# Altium schematic sheet Sheet1.SchDoc
size A
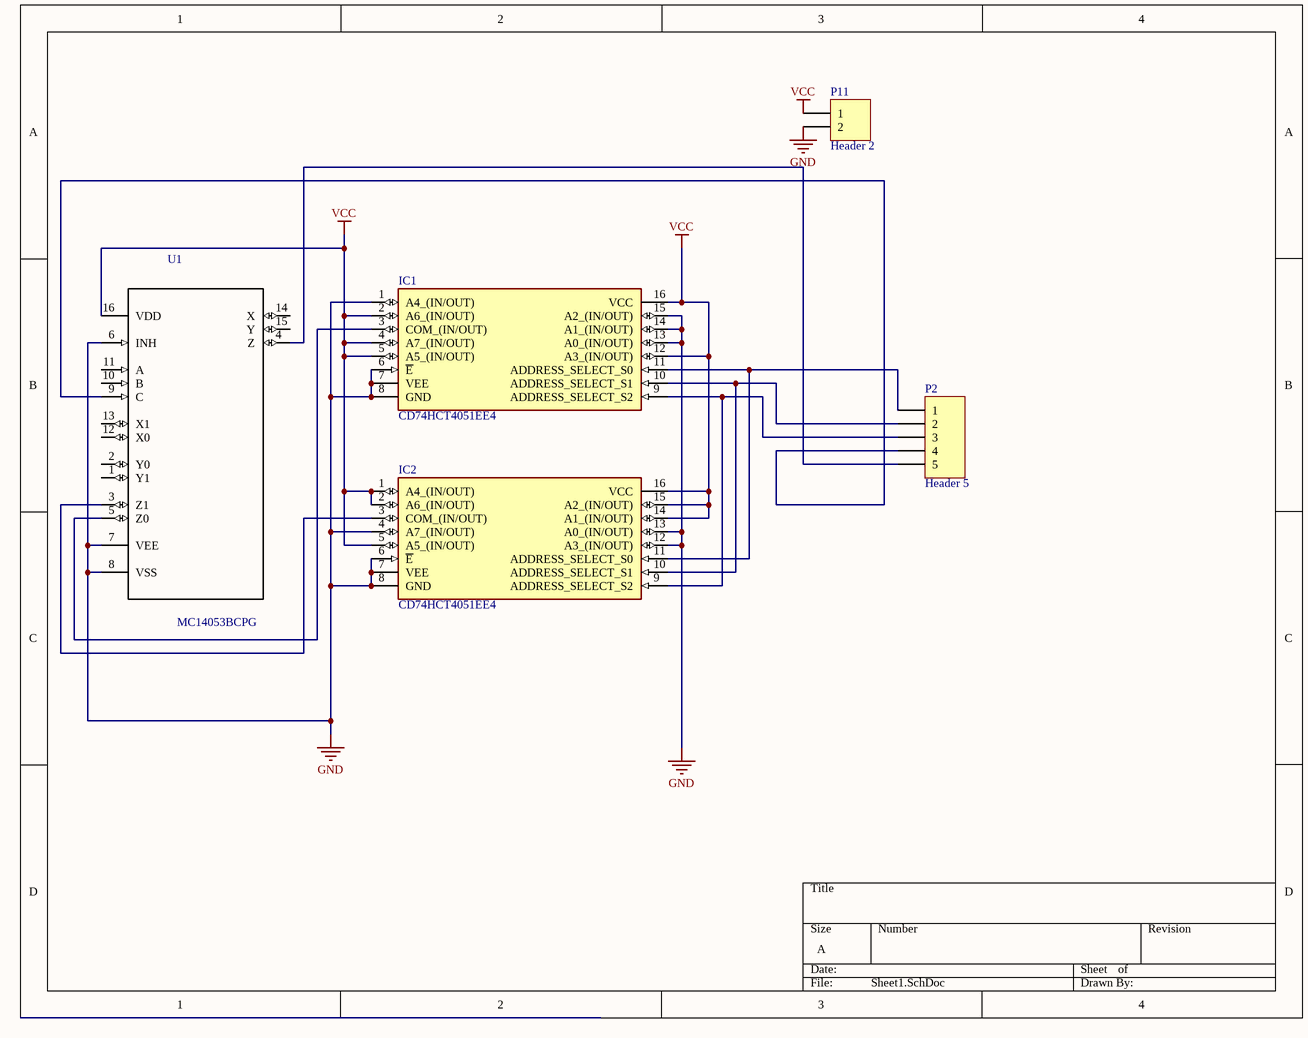
[diagram p0: Sheet1.SchDoc]

## Parts
IC1  CD74HCT4051EE4  [DIP794W53P254L1930H508Q16N]
IC2  CD74HCT4051EE4  [DIP794W53P254L1930H508Q16N]
P2  Header 5  [HDR1X5]
P11  Header 2  [HDR1X2]
U1  MC14053BCPG  [*DIP254P762X444-16]

## Nets
GND: IC1.1(A4_(IN/OUT)) IC1.6(~{E}) IC1.7(VEE) IC1.8(GND) IC1.13(A0_(IN/OUT)) IC1.14(A1_(IN/OUT)) IC1.15(A2_(IN/OUT)) IC2.4(A7_(IN/OUT)) IC2.6(~{E}) IC2.7(VEE) IC2.8(GND) IC2.12(A3_(IN/OUT)) IC2.13(A0_(IN/OUT)) P11.2 U1.6(INH) U1.7(VEE) U1.8(VSS)
VCC: IC1.2(A6_(IN/OUT)) IC1.4(A7_(IN/OUT)) IC1.5(A5_(IN/OUT)) IC1.12(A3_(IN/OUT)) IC1.16(VCC) IC2.1(A4_(IN/OUT)) IC2.2(A6_(IN/OUT)) IC2.5(A5_(IN/OUT)) IC2.14(A1_(IN/OUT)) IC2.15(A2_(IN/OUT)) IC2.16(VCC) P11.1 U1.16(VDD)
NetIC1_3: IC1.3(COM_(IN/OUT)) U1.5(Z0)
NetIC1_9: IC1.9(ADDRESS_SELECT_S2) IC2.9(ADDRESS_SELECT_S2) P2.3
NetIC1_10: IC1.10(ADDRESS_SELECT_S1) IC2.10(ADDRESS_SELECT_S1) P2.2
NetIC1_11: IC1.11(ADDRESS_SELECT_S0) IC2.11(ADDRESS_SELECT_S0) P2.1
NetIC2_3: IC2.3(COM_(IN/OUT)) U1.3(Z1)
NetP2_4: P2.4 U1.9(C)
NetP2_5: P2.5 U1.4(Z)

Not connected (* = marked no-connect by the designer): U1 1(Y1) 2(Y0) 10(B) 11(A) 12(X0) 13(X1) 14(X) 15(Y)

## Library data of the parts
IC1 IC2 = CD74HCT4051EE4: Integrated Circuit; Manufacturer_Name: Texas Instruments; Datasheet Link: http://www.alldatasheet.com/datasheet-pdf/pdf/227332/TI/CD74HCT4051EE4.html; Height: 5.08mm; Manufacturer_Part_Number: CD74HCT4051EE4; Mouser Part Number: 595-CD74HCT4051EE4; Mouser Price/Stock: https://www.mouser.com/Search/Refine.aspx?Keyword=595-CD74HCT4051EE4
P2 = Header 5: Header, 5-Pin; LatestRevisionDate: 17-Jul-2002; LatestRevisionNote: Re-released for DXP Platform.; Publisher: Altium Limited
P11 = Header 2: Header, 2-Pin; LatestRevisionDate: 17-Jul-2002; LatestRevisionNote: Re-released for DXP Platform.; Publisher: Altium Limited
U1 = MC14053BCPG: Ic Mux/Demux Triple 2x1 16dip - Mc14053bcpg; MF: ON Semiconductor; MP: MC14053BCPG; SnapEDA_Link: https://www.snapeda.com/parts/MC14053BCPG/ON%20Semiconductor/view-part/?ref=snap; Price: None; Availability: Unavailable; Package: DIP-16 ON Semiconductor; Value: *